# EAGLE schematic uSlices_v3.2 (EAGLE 8.3.2)

## Sheet 1 of 3
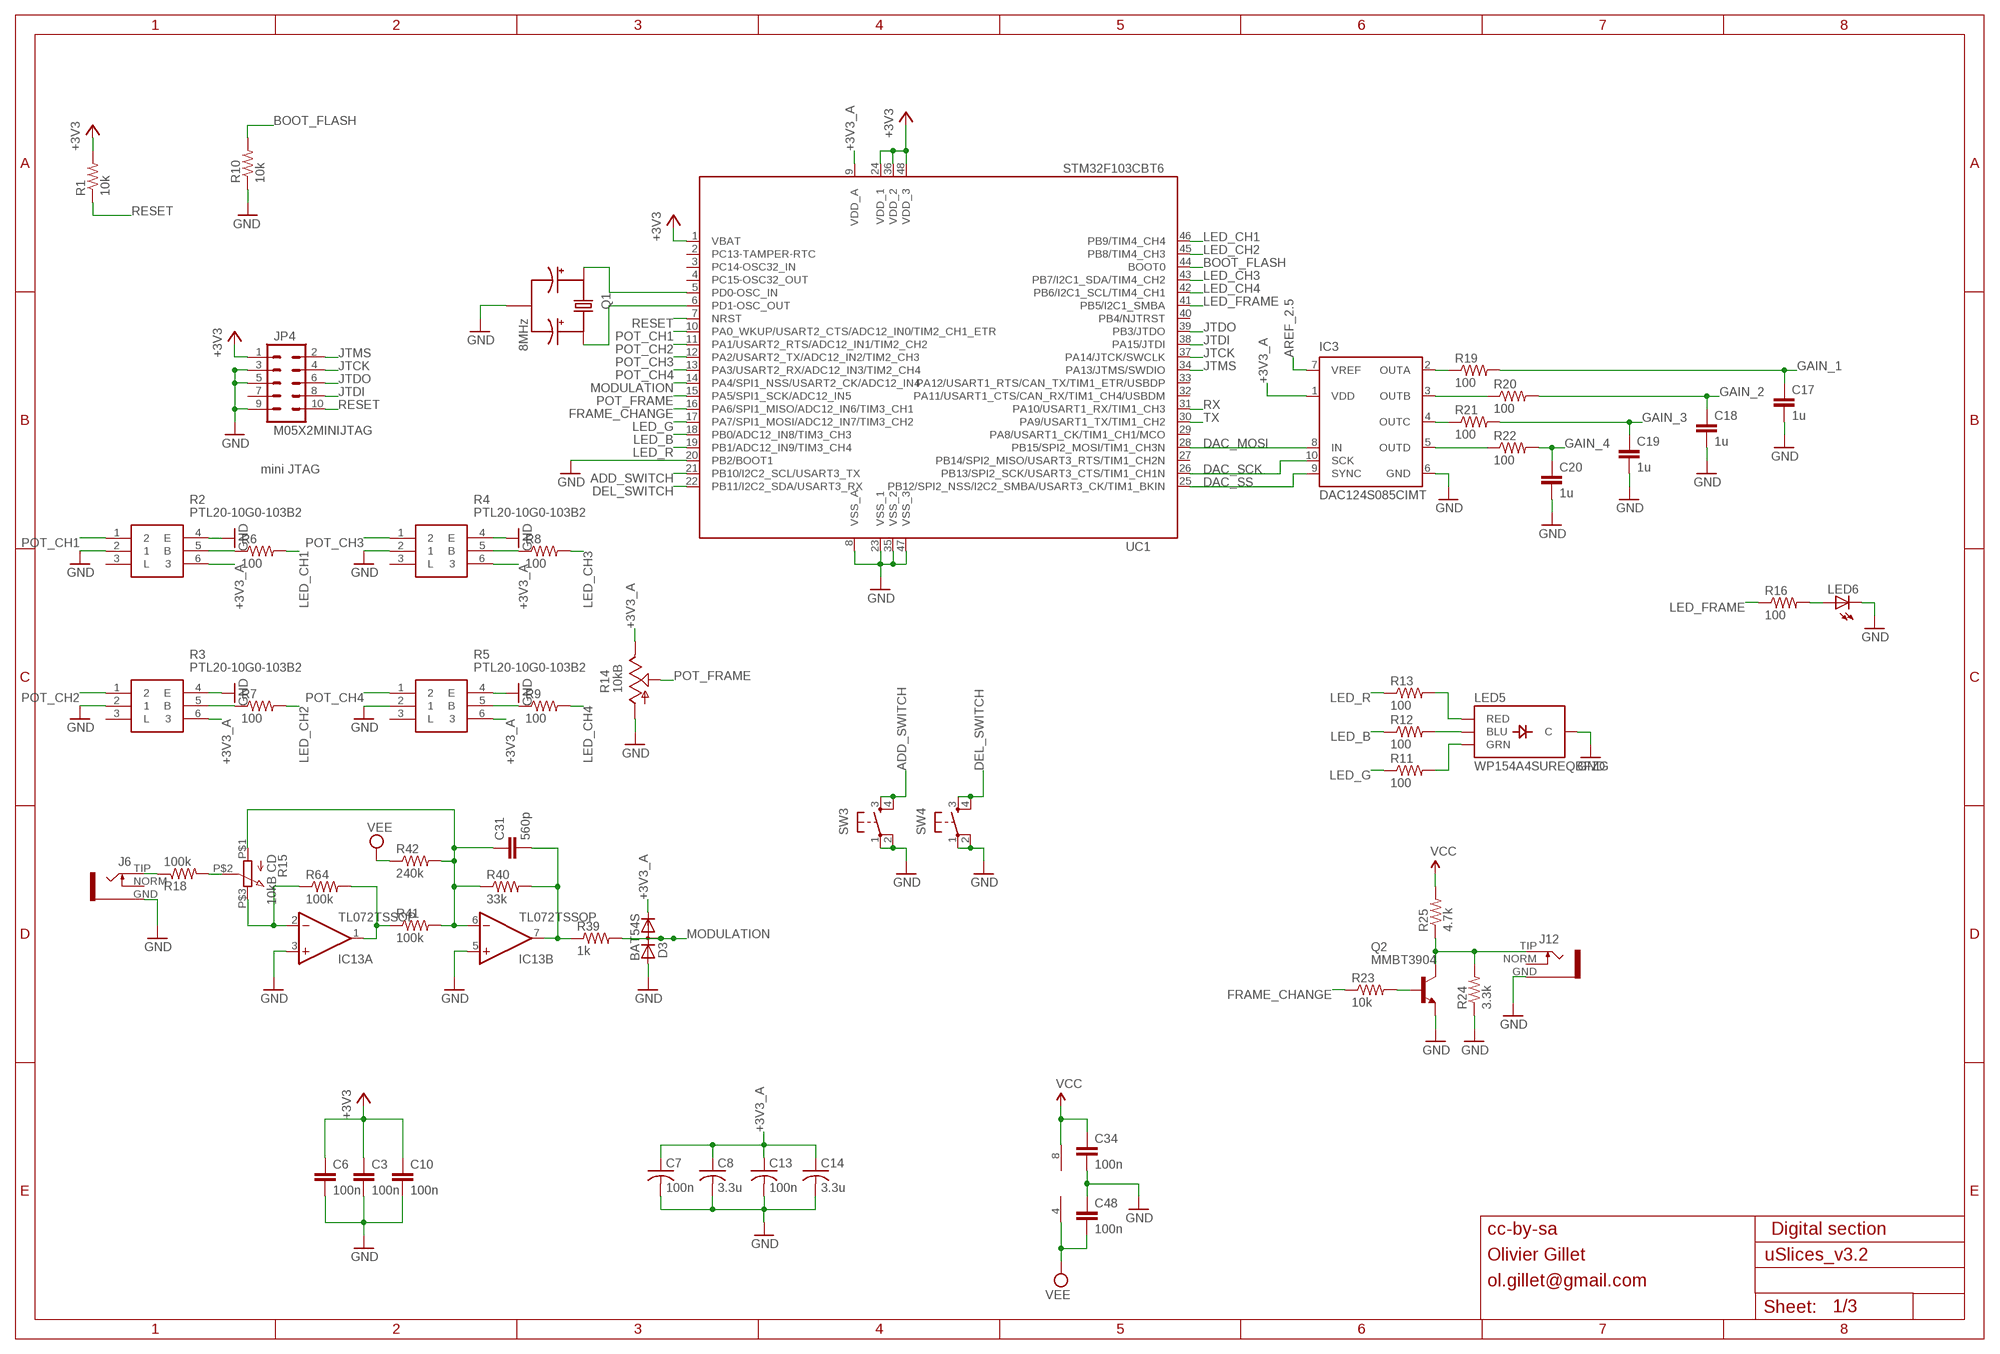
[diagram p0: schematic, sheet 1]

### Parts
C3  100n  PARTS_AMAN_CAPACITOR  [PARTS_AMAN_RESISTOR_0603]
C6  100n  PARTS_AMAN_CAPACITOR  [PARTS_AMAN_RESISTOR_0603]
C7  100n  C-USC0603  [C0603]
C8  3.3u  C-USC0603  [C0603]
C10  100n  PARTS_AMAN_CAPACITOR  [PARTS_AMAN_RESISTOR_0603]
C13  100n  C-USC0603  [C0603]
C14  3.3u  C-USC0603  [C0603]
C17  1u  PARTS_AMAN_CAPACITOR  [PARTS_AMAN_RESISTOR_0603]
C18  1u  PARTS_AMAN_CAPACITOR  [PARTS_AMAN_RESISTOR_0603]
C19  1u  PARTS_AMAN_CAPACITOR  [PARTS_AMAN_RESISTOR_0603]
C20  1u  PARTS_AMAN_CAPACITOR  [PARTS_AMAN_RESISTOR_0603]
C31  560p  PARTS_AMAN_CAPACITOR  [PARTS_AMAN_RESISTOR_0603]
C34  100n  PARTS_AMAN_CAPACITOR  [PARTS_AMAN_RESISTOR_0603]
C48  100n  PARTS_AMAN_CAPACITOR  [PARTS_AMAN_RESISTOR_0603]
D3  BAT54S  DIODE_2CACA-SOT23  [SOT23]
IC3  DAC124S085CIMT  [MSOP10]
IC13  TL072TSSOP  [TSSOP-8]
J6  INSTRUO_S_JACK_S2_INV  [INSTRUO_S_JACK_S2_INV]
J12  INSTRUO_S_JACK_S2_INV  [INSTRUO_S_JACK_S2_INV]
JP4  M05X2MINIJTAG  [2X5-1.27]
LED5  WP154A4SUREQBFZG  LED-TRICOLOR-THROUGHHOLE  [LED-TRICOLOR-THROUGHHOLE]
LED6  LED3MM  [LED3MM]
Q1  8MHz  INSTRUO_CRYSTAL_SMALLER  [INSTRUO_CRYSTAL_SMALLER]
Q2  MMBT3904  MMBT3904LT1-NPN-SOT23-BEC  [SOT23-BEC]
R1  10k  PARTS_AMAN_RESISTOR  [PARTS_AMAN_RESISTOR_0603]
R2  PTL20-10G0-103B2  [PTL2010G0103B2]
R3  PTL20-10G0-103B2  [PTL2010G0103B2]
R4  PTL20-10G0-103B2  [PTL2010G0103B2]
R5  PTL20-10G0-103B2  [PTL2010G0103B2]
R6  100  PARTS_AMAN_RESISTOR  [PARTS_AMAN_RESISTOR_0603]
R7  100  PARTS_AMAN_RESISTOR  [PARTS_AMAN_RESISTOR_0603]
R8  100  PARTS_AMAN_RESISTOR  [PARTS_AMAN_RESISTOR_0603]
R9  100  PARTS_AMAN_RESISTOR  [PARTS_AMAN_RESISTOR_0603]
R10  10k  PARTS_AMAN_RESISTOR  [PARTS_AMAN_RESISTOR_0603]
R11  100  PARTS_AMAN_RESISTOR  [PARTS_AMAN_RESISTOR_0603]
R12  100  PARTS_AMAN_RESISTOR  [PARTS_AMAN_RESISTOR_0603]
R13  100  PARTS_AMAN_RESISTOR  [PARTS_AMAN_RESISTOR_0603]
R14  10kB  POT_USVERTICAL_PS  [ALPS_POT_VERTICAL_PS]
R15  10kB CD  INSTRUO_Q-POT2  [INSTRUO_Q-POT2]
R16  100  PARTS_AMAN_RESISTOR  [PARTS_AMAN_RESISTOR_0603]
R18  100k  R-US_R0603  [R0603]
R19  100  PARTS_AMAN_RESISTOR  [PARTS_AMAN_RESISTOR_0603]
R20  100  PARTS_AMAN_RESISTOR  [PARTS_AMAN_RESISTOR_0603]
R21  100  PARTS_AMAN_RESISTOR  [PARTS_AMAN_RESISTOR_0603]
R22  100  PARTS_AMAN_RESISTOR  [PARTS_AMAN_RESISTOR_0603]
R23  10k  PARTS_AMAN_RESISTOR  [PARTS_AMAN_RESISTOR_0603]
R24  3.3k  PARTS_AMAN_RESISTOR  [PARTS_AMAN_RESISTOR_0603]
R25  4.7k  PARTS_AMAN_RESISTOR  [PARTS_AMAN_RESISTOR_0603]
R39  1k  PARTS_AMAN_RESISTOR  [PARTS_AMAN_RESISTOR_0603]
R40  33k  PARTS_AMAN_RESISTOR  [PARTS_AMAN_RESISTOR_0603]
R41  100k  PARTS_AMAN_RESISTOR  [PARTS_AMAN_RESISTOR_0603]
R42  240k  PARTS_AMAN_RESISTOR  [PARTS_AMAN_RESISTOR_0603]
R64  100k  PARTS_AMAN_RESISTOR  [PARTS_AMAN_RESISTOR_0603]
SW3  SPARKFUN_TAC_SWITCHPTH  [SPARKFUN_TACTILE-PTH]
SW4  SPARKFUN_TAC_SWITCHPTH  [SPARKFUN_TACTILE-PTH]
UC1  STM32F103CBT6  STM32F103CB  [LQFP48]

### Nets
+3V3: C3.1 C6.1 C10.1 JP4.1 R1.2 UC1.1(VBAT) UC1.24(VDD_1) UC1.36(VDD_2) UC1.48(VDD_3) ; also sheet 3
+3V3_A: C7.1 C8.1 C13.1 C14.1 D3.2(C) IC3.1(VDD) R2.6 R3.6 R4.6 R5.6 R14.P$1(E) UC1.9(VDD_A) ; also sheet 3
ADD_SWITCH: SW3.3 SW3.4 UC1.21(PB10/I2C2_SCL/USART3_TX)
AREF_2.5: IC3.7(VREF) ; also sheet 3
BOOT_FLASH: R10.2 UC1.44(BOOT0)
DAC_MOSI: IC3.8(IN) UC1.28(PB15/SPI2_MOSI/TIM1_CH3N)
DAC_SCK: IC3.10(SCK) UC1.26(PB13/SPI2_SCK/USART3_CTS/TIM1_CH1N)
DAC_SS: IC3.9(SYNC) UC1.25(PB12/SPI2_NSS/I2C2_SMBA/USART3_CK/TIM1_BKIN)
DEL_SWITCH: SW4.3 SW4.4 UC1.22(PB11/I2C2_SDA/USART3_RX)
FRAME_CHANGE: R23.1 UC1.16(PA6/SPI1_MISO/ADC12_IN6/TIM3_CH1)
GAIN_1: C17.1 R19.2 ; also sheet 2
GAIN_2: C18.1 R20.2 ; also sheet 2
GAIN_3: C19.1 R21.2 ; also sheet 2
GAIN_4: C20.1 R22.2 ; also sheet 2
GND: C3.2 C6.2 C7.2 C8.2 C10.2 C13.2 C14.2 C17.2 C18.2 C19.2 C20.2 C34.2 C48.1 D3.1(A) IC3.6(GND) IC13.3(A:+IN) IC13.5(B:+IN) J6.GND J12.GND JP4.3 JP4.5 JP4.9 LED5.GND(C) LED6.K(C) Q1.GND Q2.E R2.2 R2.4(E) R3.2 R3.4(E) R4.2 R4.4(E) R5.2 R5.4(E) R10.1 R14.P$3(A) R24.1 SW3.1 SW3.2 SW4.1 SW4.2 UC1.8(VSS_A) UC1.20(PB2/BOOT1) UC1.23(VSS_1) UC1.35(VSS_2) UC1.47(VSS_3) ; also sheet 2,3
JTCK: JP4.4 UC1.37(PA14/JTCK/SWCLK)
JTDI: JP4.8 UC1.38(PA15/JTDI)
JTDO: JP4.6 UC1.39(PB3/JTDO)
JTMS: JP4.2 UC1.34(PA13/JTMS/SWDIO)
LED_B: R12.1 UC1.18(PB0/ADC12_IN8/TIM3_CH3)
LED_CH1: R6.2 UC1.46(PB9/TIM4_CH4)
LED_CH2: R7.2 UC1.45(PB8/TIM4_CH3)
LED_CH3: R8.2 UC1.43(PB7/I2C1_SDA/TIM4_CH2)
LED_CH4: R9.2 UC1.42(PB6/I2C1_SCL/TIM4_CH1)
LED_FRAME: R16.1 UC1.41(PB5/I2C1_SMBA)
LED_G: R11.1 UC1.17(PA7/SPI1_MOSI/ADC12_IN7/TIM3_CH2)
LED_R: R13.1 UC1.19(PB1/ADC12_IN9/TIM3_CH4)
MODULATION: D3.3(AC) R39.2 UC1.14(PA4/SPI1_NSS/USART2_CK/ADC12_IN4)
N$1: IC13.2(A:-IN) R15.P$3 R64.1
N$5: R15.P$2 R18.2
N$6: R2.5(B) R6.1
N$7: Q1.X1 UC1.5(PD0-OSC_IN)
N$8: Q1.X2 UC1.6(PD1-OSC_OUT)
N$9: IC13.1(A:OUT) R41.1 R64.2
N$11: J6.TIP R18.1
N$13: C31.2 IC13.7(B:OUT) R39.1 R40.2
N$14: C31.1 IC13.6(B:-IN) R15.P$1 R40.1 R41.2 R42.2
N$25: LED6.A R16.2
N$35: LED5.RED R13.2
N$36: LED5.BLU R12.2
N$37: LED5.GRN R11.2
N$38: R3.5(B) R7.1
N$39: IC3.2(OUTA) R19.1
N$41: IC3.3(OUTB) R20.1
N$43: IC3.4(OUTC) R21.1
N$44: J12.TIP Q2.C R24.2 R25.1
N$45: IC3.5(OUTD) R22.1
N$46: R4.5(B) R8.1
N$47: Q2.B R23.2
N$52: R5.5(B) R9.1
POT_CH1: R2.1 UC1.10(PA0_WKUP/USART2_CTS/ADC12_IN0/TIM2_CH1_ETR)
POT_CH2: R3.1 UC1.11(PA1/USART2_RTS/ADC12_IN1/TIM2_CH2)
POT_CH3: R4.1 UC1.12(PA2/USART2_TX/ADC12_IN2/TIM2_CH3)
POT_CH4: R5.1 UC1.13(PA3/USART2_RX/ADC12_IN3/TIM2_CH4)
POT_FRAME: R14.P$2(S) UC1.15(PA5/SPI1_SCK/ADC12_IN5)
RESET: JP4.10 R1.1 UC1.7(NRST)
RX: UC1.31(PA10/USART1_RX/TIM1_CH3)
TX: UC1.30(PA9/USART1_TX/TIM1_CH2)
VCC: C34.1 IC13.8(P:V+) R25.2 ; also sheet 2,3
VEE: C48.2 IC13.4(P:V-) R42.1 ; also sheet 2,3
Unconnected: J6.NORM J12.NORM JP4.7 R2.3(L) R3.3(L) R4.3(L) R5.3(L) UC1.2(PC13-TAMPER-RTC) UC1.3(PC14-OSC32_IN) UC1.4(PC15-OSC32_OUT) UC1.27(PB14/SPI2_MISO/USART3_RTS/TIM1_CH2N) UC1.29(PA8/USART1_CK/TIM1_CH1/MCO) UC1.32(PA11/USART1_CTS/CAN_RX/TIM1_CH4/USBDM) UC1.33(PA12/USART1_RTS/CAN_TX/TIM1_ETR/USBDP) UC1.40(PB4/NJTRST)

### Notes on the sheet
- mini JTAG
- cc-by-sa | Digital section
- Olivier Gillet
- ol.gillet@gmail.com

## Sheet 2 of 3
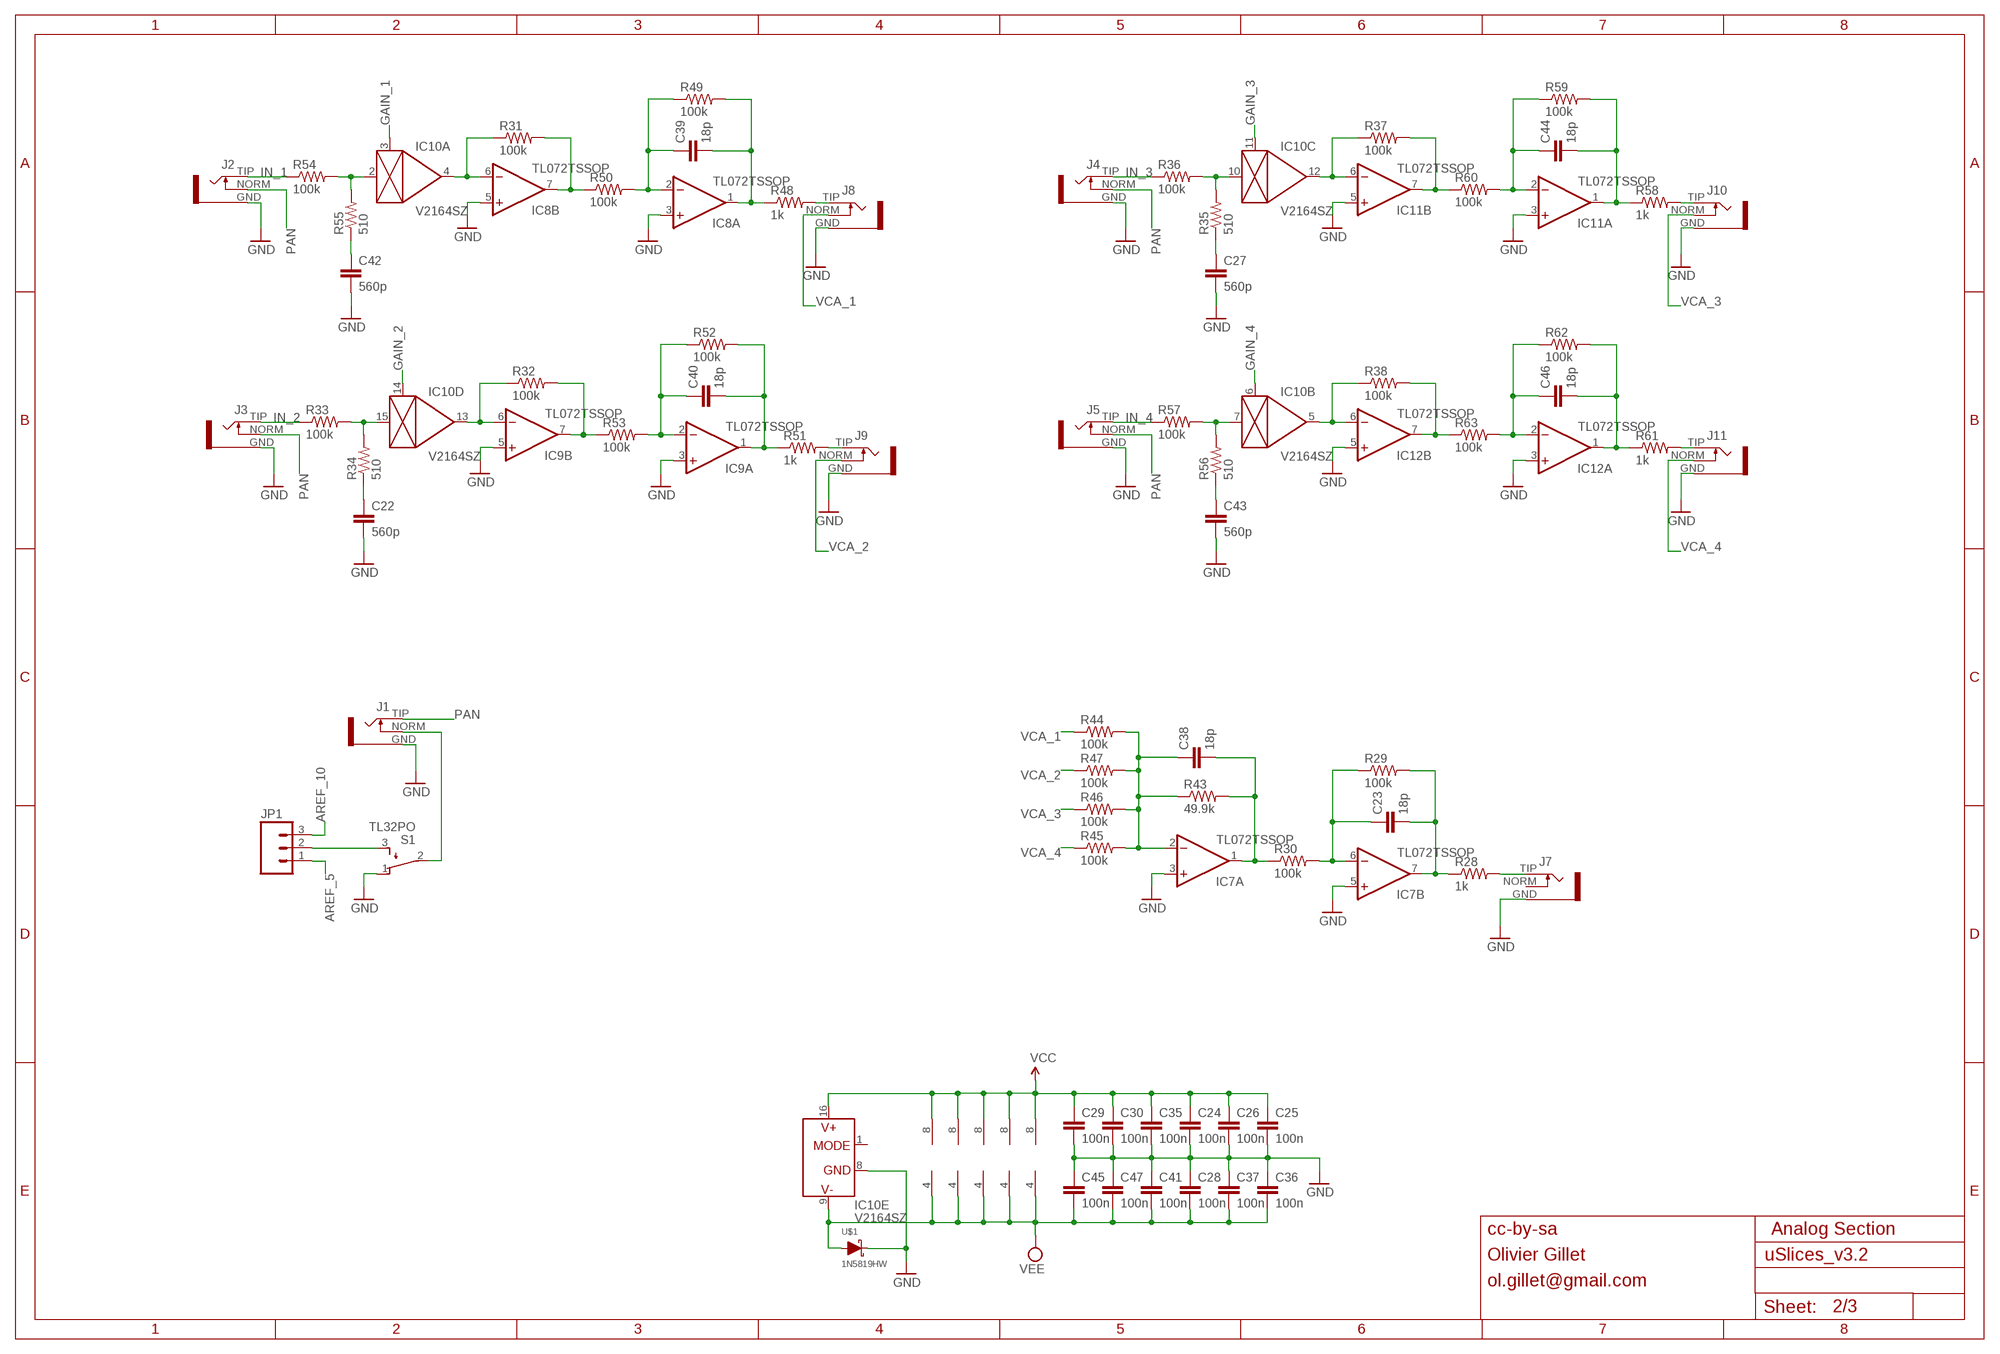
[diagram p1: schematic, sheet 2]

### Parts
C22  560p  PARTS_AMAN_CAPACITOR  [PARTS_AMAN_RESISTOR_0603]
C23  18p  PARTS_AMAN_CAPACITOR  [PARTS_AMAN_RESISTOR_0603]
C24  100n  PARTS_AMAN_CAPACITOR  [PARTS_AMAN_RESISTOR_0603]
C25  100n  PARTS_AMAN_CAPACITOR  [PARTS_AMAN_RESISTOR_0603]
C26  100n  PARTS_AMAN_CAPACITOR  [PARTS_AMAN_RESISTOR_0603]
C27  560p  PARTS_AMAN_CAPACITOR  [PARTS_AMAN_RESISTOR_0603]
C28  100n  PARTS_AMAN_CAPACITOR  [PARTS_AMAN_RESISTOR_0603]
C29  100n  PARTS_AMAN_CAPACITOR  [PARTS_AMAN_RESISTOR_0603]
C30  100n  PARTS_AMAN_CAPACITOR  [PARTS_AMAN_RESISTOR_0603]
C35  100n  PARTS_AMAN_CAPACITOR  [PARTS_AMAN_RESISTOR_0603]
C36  100n  PARTS_AMAN_CAPACITOR  [PARTS_AMAN_RESISTOR_0603]
C37  100n  PARTS_AMAN_CAPACITOR  [PARTS_AMAN_RESISTOR_0603]
C38  18p  PARTS_AMAN_CAPACITOR  [PARTS_AMAN_RESISTOR_0603]
C39  18p  PARTS_AMAN_CAPACITOR  [PARTS_AMAN_RESISTOR_0603]
C40  18p  PARTS_AMAN_CAPACITOR  [PARTS_AMAN_RESISTOR_0603]
C41  100n  PARTS_AMAN_CAPACITOR  [PARTS_AMAN_RESISTOR_0603]
C42  560p  PARTS_AMAN_CAPACITOR  [PARTS_AMAN_RESISTOR_0603]
C43  560p  PARTS_AMAN_CAPACITOR  [PARTS_AMAN_RESISTOR_0603]
C44  18p  PARTS_AMAN_CAPACITOR  [PARTS_AMAN_RESISTOR_0603]
C45  100n  PARTS_AMAN_CAPACITOR  [PARTS_AMAN_RESISTOR_0603]
C46  18p  PARTS_AMAN_CAPACITOR  [PARTS_AMAN_RESISTOR_0603]
C47  100n  PARTS_AMAN_CAPACITOR  [PARTS_AMAN_RESISTOR_0603]
IC7  TL072TSSOP  [TSSOP-8]
IC8  TL072TSSOP  [TSSOP-8]
IC9  TL072TSSOP  [TSSOP-8]
IC10  V2164SZ  SSM2164S  [SOIC16N]
IC11  TL072TSSOP  [TSSOP-8]
IC12  TL072TSSOP  [TSSOP-8]
J1  INSTRUO_S_JACK_S2_INV  [INSTRUO_S_JACK_S2_INV]
J2  INSTRUO_S_JACK_S2_INV  [INSTRUO_S_JACK_S2_INV]
J3  INSTRUO_S_JACK_S2_INV  [INSTRUO_S_JACK_S2_INV]
J4  INSTRUO_S_JACK_S2_INV  [INSTRUO_S_JACK_S2_INV]
J5  INSTRUO_S_JACK_S2_INV  [INSTRUO_S_JACK_S2_INV]
J7  INSTRUO_S_JACK_S2_INV  [INSTRUO_S_JACK_S2_INV]
J8  INSTRUO_S_JACK_S2_INV  [INSTRUO_S_JACK_S2_INV]
J9  INSTRUO_S_JACK_S2_INV  [INSTRUO_S_JACK_S2_INV]
J10  INSTRUO_S_JACK_S2_INV  [INSTRUO_S_JACK_S2_INV]
J11  INSTRUO_S_JACK_S2_INV  [INSTRUO_S_JACK_S2_INV]
JP1  M03PTH  [1X03]
R28  1k  PARTS_AMAN_RESISTOR  [PARTS_AMAN_RESISTOR_0603]
R29  100k  PARTS_AMAN_RESISTOR  [PARTS_AMAN_RESISTOR_0603]
R30  100k  PARTS_AMAN_RESISTOR  [PARTS_AMAN_RESISTOR_0603]
R31  100k  PARTS_AMAN_RESISTOR  [PARTS_AMAN_RESISTOR_0603]
R32  100k  PARTS_AMAN_RESISTOR  [PARTS_AMAN_RESISTOR_0603]
R33  100k  PARTS_AMAN_RESISTOR  [PARTS_AMAN_RESISTOR_0603]
R34  510  PARTS_AMAN_RESISTOR  [PARTS_AMAN_RESISTOR_0603]
R35  510  PARTS_AMAN_RESISTOR  [PARTS_AMAN_RESISTOR_0603]
R36  100k  PARTS_AMAN_RESISTOR  [PARTS_AMAN_RESISTOR_0603]
R37  100k  PARTS_AMAN_RESISTOR  [PARTS_AMAN_RESISTOR_0603]
R38  100k  PARTS_AMAN_RESISTOR  [PARTS_AMAN_RESISTOR_0603]
R43  49.9k  PARTS_AMAN_RESISTOR  [PARTS_AMAN_RESISTOR_0603]
R44  100k  PARTS_AMAN_RESISTOR  [PARTS_AMAN_RESISTOR_0603]
R45  100k  PARTS_AMAN_RESISTOR  [PARTS_AMAN_RESISTOR_0603]
R46  100k  PARTS_AMAN_RESISTOR  [PARTS_AMAN_RESISTOR_0603]
R47  100k  PARTS_AMAN_RESISTOR  [PARTS_AMAN_RESISTOR_0603]
R48  1k  PARTS_AMAN_RESISTOR  [PARTS_AMAN_RESISTOR_0603]
R49  100k  PARTS_AMAN_RESISTOR  [PARTS_AMAN_RESISTOR_0603]
R50  100k  PARTS_AMAN_RESISTOR  [PARTS_AMAN_RESISTOR_0603]
R51  1k  PARTS_AMAN_RESISTOR  [PARTS_AMAN_RESISTOR_0603]
R52  100k  PARTS_AMAN_RESISTOR  [PARTS_AMAN_RESISTOR_0603]
R53  100k  PARTS_AMAN_RESISTOR  [PARTS_AMAN_RESISTOR_0603]
R54  100k  PARTS_AMAN_RESISTOR  [PARTS_AMAN_RESISTOR_0603]
R55  510  PARTS_AMAN_RESISTOR  [PARTS_AMAN_RESISTOR_0603]
R56  510  PARTS_AMAN_RESISTOR  [PARTS_AMAN_RESISTOR_0603]
R57  100k  PARTS_AMAN_RESISTOR  [PARTS_AMAN_RESISTOR_0603]
R58  1k  PARTS_AMAN_RESISTOR  [PARTS_AMAN_RESISTOR_0603]
R59  100k  PARTS_AMAN_RESISTOR  [PARTS_AMAN_RESISTOR_0603]
R60  100k  PARTS_AMAN_RESISTOR  [PARTS_AMAN_RESISTOR_0603]
R61  1k  PARTS_AMAN_RESISTOR  [PARTS_AMAN_RESISTOR_0603]
R62  100k  PARTS_AMAN_RESISTOR  [PARTS_AMAN_RESISTOR_0603]
R63  100k  PARTS_AMAN_RESISTOR  [PARTS_AMAN_RESISTOR_0603]
S1  TL32PO  [TL3XPO]
U$1  1N5819HW  [SOD123]

### Nets
AREF_5: JP1.1 ; also sheet 3
AREF_10: JP1.3 ; also sheet 3
FB_CURRENT: IC10.2(A:IN) R54.2 R55.2
FB_CURRENT1: IC10.15(D:IN) R33.2 R34.2
FB_CURRENT2: IC10.10(C:IN) R35.2 R36.2
FB_CURRENT3: IC10.7(B:IN) R56.2 R57.2
GAIN_1: IC10.3(A:CTRL) ; also sheet 1
GAIN_2: IC10.14(D:CTRL) ; also sheet 1
GAIN_3: IC10.11(C:CTRL) ; also sheet 1
GAIN_4: IC10.6(B:CTRL) ; also sheet 1
GND: C22.2 C24.2 C25.2 C26.2 C27.2 C28.1 C29.2 C30.2 C35.2 C36.1 C37.1 C41.1 C42.2 C43.2 C45.1 C47.1 IC7.3(A:+IN) IC7.5(B:+IN) IC8.3(A:+IN) IC8.5(B:+IN) IC9.3(A:+IN) IC9.5(B:+IN) IC10.8(E:GND) IC11.3(A:+IN) IC11.5(B:+IN) IC12.3(A:+IN) IC12.5(B:+IN) J1.GND J2.GND J3.GND J4.GND J5.GND J7.GND J8.GND J9.GND J10.GND J11.GND S1.1(O) U$1.C(K) ; also sheet 1,3
IN_1: J2.TIP R54.1
IN_2: J3.TIP R33.1
IN_3: J4.TIP R36.1
IN_4: J5.TIP R57.1
N$2: C42.1 R55.1
N$3: J7.TIP R28.2
N$4: IC9.7(B:OUT) R32.2 R53.1
N$10: C27.1 R35.1
N$12: IC8.6(B:-IN) IC10.4(A:OUT) R31.1
N$15: C39.1 IC8.2(A:-IN) R49.1 R50.2
N$16: C39.2 IC8.1(A:OUT) R48.1 R49.2
N$17: C23.2 IC7.7(B:OUT) R28.1 R29.2
N$18: C22.1 R34.1
N$19: C38.1 IC7.2(A:-IN) R43.1 R44.2 R45.2 R46.2 R47.2
N$20: IC9.6(B:-IN) IC10.13(D:OUT) R32.1
N$21: C23.1 IC7.6(B:-IN) R29.1 R30.2
N$22: C40.1 IC9.2(A:-IN) R52.1 R53.2
N$23: C40.2 IC9.1(A:OUT) R51.1 R52.2
N$24: IC10.12(C:OUT) IC11.6(B:-IN) R37.1
N$26: C44.1 IC11.2(A:-IN) R59.1 R60.2
N$27: C44.2 IC11.1(A:OUT) R58.1 R59.2
N$28: C43.1 R56.1
N$29: C38.2 IC7.1(A:OUT) R30.1 R43.2
N$30: IC10.5(B:OUT) IC12.6(B:-IN) R38.1
N$32: C46.1 IC12.2(A:-IN) R62.1 R63.2
N$33: C46.2 IC12.1(A:OUT) R61.1 R62.2
N$34: J1.NORM S1.2(P)
N$40: J8.TIP R48.2
N$42: JP1.2 S1.3(S)
N$48: IC12.7(B:OUT) R38.2 R63.1
N$49: J9.TIP R51.2
N$50: J11.TIP R61.2
N$51: J10.TIP R58.2
PAN: J1.TIP J2.NORM J3.NORM J4.NORM J5.NORM
VCA0_1: IC8.7(B:OUT) R31.2 R50.1
VCA0_3: IC11.7(B:OUT) R37.2 R60.1
VCA_1: J8.NORM R44.1
VCA_2: J9.NORM R47.1
VCA_3: J10.NORM R46.1
VCA_4: J11.NORM R45.1
VCC: C24.1 C25.1 C26.1 C29.1 C30.1 C35.1 IC7.8(P:V+) IC8.8(P:V+) IC9.8(P:V+) IC10.16(E:V+) IC11.8(P:V+) IC12.8(P:V+) ; also sheet 1,3
VEE: C28.2 C36.2 C37.2 C41.2 C45.2 C47.2 IC7.4(P:V-) IC8.4(P:V-) IC9.4(P:V-) IC10.9(E:V-) IC11.4(P:V-) IC12.4(P:V-) U$1.A ; also sheet 1,3
Unconnected: IC10.1(E:MODE) J7.NORM

### Notes on the sheet
- cc-by-sa | Analog Section
- Olivier Gillet
- ol.gillet@gmail.com

## Sheet 3 of 3
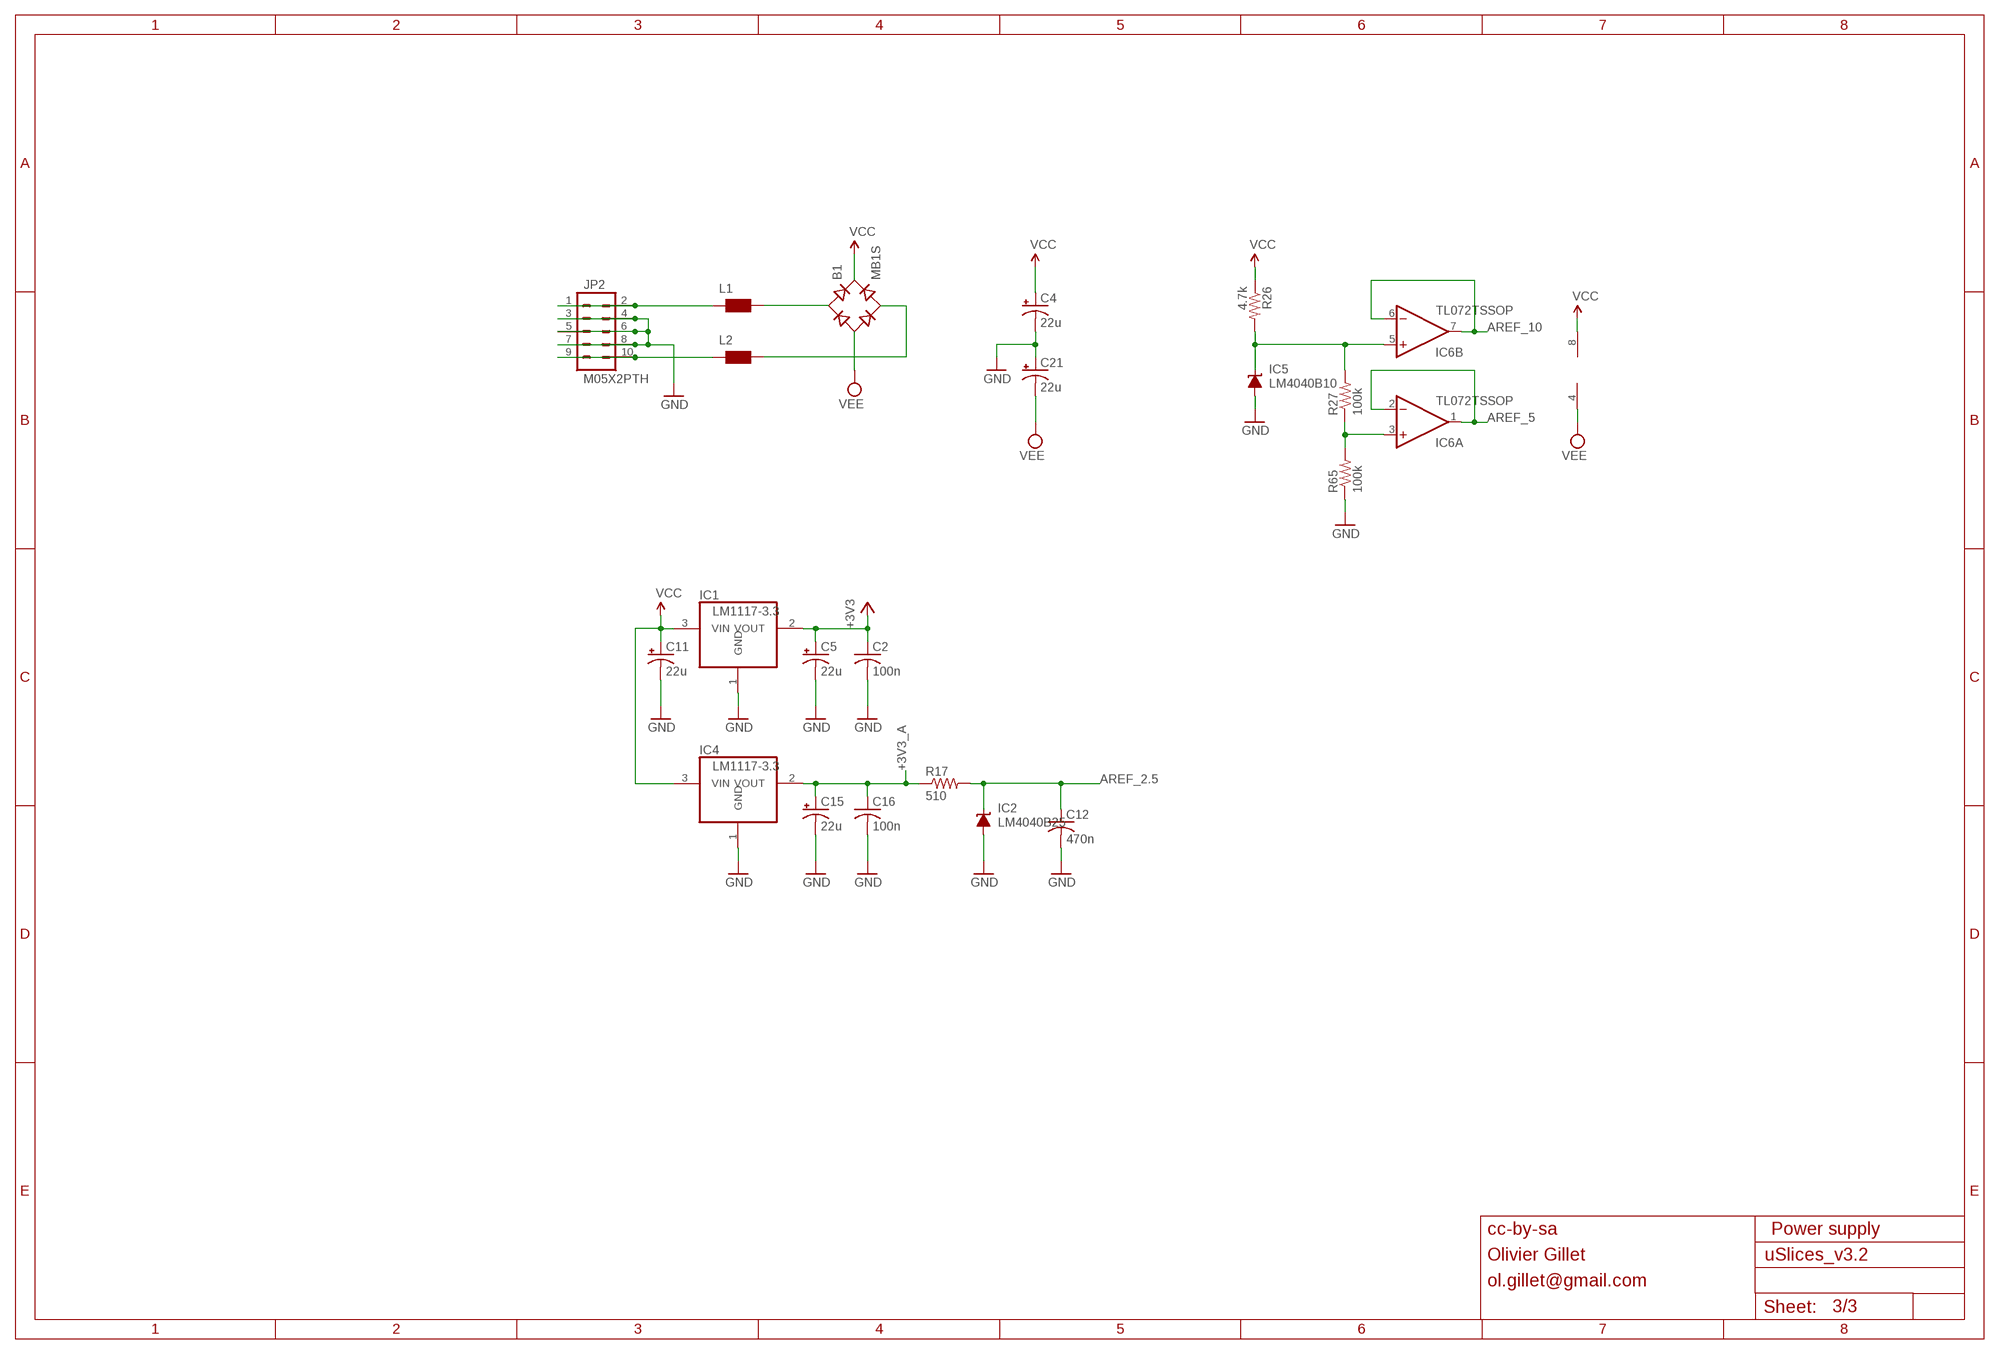
[diagram p2: schematic, sheet 3]

### Parts
B1  MB1S  [SOIC-4]
C2  100n  C-USC0603  [C0603]
C4  22u  CPOL-USC  [PANASONIC_C]
C5  22u  CPOL-USC  [PANASONIC_C]
C11  22u  CPOL-USC  [PANASONIC_C]
C12  470n  C-USC0603  [C0603]
C15  22u  CPOL-USC  [PANASONIC_C]
C16  100n  C-USC0603  [C0603]
C21  22u  CPOL-USC  [PANASONIC_C]
IC1  LM1117-3.3  REG1117  [SOT223]
IC2  LM4040B25  LM4041B12DBZ  [DBZ_R-PDSO-G3]
IC4  LM1117-3.3  REG1117  [SOT223]
IC5  LM4040B10  LM4041B12DBZ  [DBZ_R-PDSO-G3]
IC6  TL072TSSOP  [TSSOP-8]
JP2  M05X2PTH  [AVR_ICSP]
L1  WUERTH-ELEKTRONIK_WE-CBF_0603  [WUERTH-ELEKTRONIK_0603]
L2  WUERTH-ELEKTRONIK_WE-CBF_0603  [WUERTH-ELEKTRONIK_0603]
R17  510  R-US_R0603  [R0603]
R26  4.7k  R-US_R0603  [R0603]
R27  100k  R-US_R0603  [R0603]
R65  100k  R-US_R0603  [R0603]

### Nets
+3V3: C2.1 C5.+ IC1.2(VOUT) ; also sheet 1
+3V3_A: C15.+ C16.1 IC4.2(VOUT) R17.1 ; also sheet 1
AREF_2.5: C12.1 IC2.1(C) R17.2 ; also sheet 1
AREF_5: IC6.1(A:OUT) IC6.2(A:-IN) ; also sheet 2
AREF_10: IC6.6(B:-IN) IC6.7(B:OUT) ; also sheet 2
AREF_10_0: IC5.1(C) IC6.5(B:+IN) R26.2 R27.2
GND: C2.2 C4.- C5.- C11.- C12.2 C15.- C16.2 C21.+ IC1.1(GND) IC2.2(A) IC4.1(GND) IC5.2(A) JP2.3 JP2.4 JP2.5 JP2.6 JP2.7 JP2.8 R65.1 ; also sheet 1,2
N$31: IC6.3(A:+IN) R27.1 R65.2
N$53: B1.~1(AC1) L1.2
N$54: B1.~2(AC2) L2.2
N$56: JP2.1 JP2.2 L1.1
N$64: JP2.9 JP2.10 L2.1
VCC: B1.+ C4.+ C11.+ IC1.3(VIN) IC4.3(VIN) IC6.8(P:V+) R26.1 ; also sheet 1,2
VEE: B1.- C21.- IC6.4(P:V-) ; also sheet 1,2

### Notes on the sheet
- cc-by-sa | Power supply
- Olivier Gillet
- ol.gillet@gmail.com

## Library data of the parts
B1 = rectifier:MB*S: Bridge Rectifier Source: http://www.fairchildsemi.com/ds/MB/MB6S.pdf
C2 C7 C8 C12-C14 C16 = rcl:C-US: CAPACITOR, American symbol
C3 C6 C10 C17-C20 C22-C31 C34-C48 = atom_v1_1_board_2:PARTS_AMAN_CAPACITOR
C4 C5 C11 C15 C21 = rcl:CPOL-US: POLARIZED CAPACITOR, American symbol
D3 = diode:DIODE_2CACA-: 2 Diodes - Cathode-Anode|Cathode-Anode
IC1 IC4 = og-vreg:REG1117: 800mA and 1A Low Dropout (LDO) Positive Regulator 1.8V, 2.5V, 2.85V, 3.3V, 5V, and Adj
IC2 IC5 = texas:LM4041: PRECISION MICROPOWER SHUNT VOLTAGE REFERENCE Source: http://focus.ti.com/lit/ds/slcs146e/slcs146e.pdf
IC3 = og-dac:DAC124S085CIMT
IC6-IC9 IC11-IC13 = MusicThingModular:TL072: Generic Dual Op Amp
IC10 = ssm2164:SSM2164
J1-J12 = uClouds_002_:INSTRUO_S_JACK_S2_INV
JP1 = SparkFun:M03: Header 3 Standard 3-pin 0.1" header. Use with straight break away headers (SKU : PRT-00116), right angle break away headers (PRT-00553), swiss pins (PRT-00743), machine pins (PRT-00117), and female headers (PRT-00115). Molex polarized connector foot print use with SKU : PRT-08232 with associated crimp pins and housings.
JP2 JP4 = og-header:M05X2: Header 5x2 Standard 10-pin dual row 0.1" header. Commonly used with AVR-ISP. Use with Spark Fun Electronics SKU: PRT-00778
L1 L2 = osc_2 board_2_v2.0:WUERTH-ELEKTRONIK_WE-CBF: SMD EMI Suppression Ferrite Beads - excellent anti-EMI properties - low DCR - impedances till 3000 ohms - rated current up to 6 A
LED5 = og-leds:LED-TRICOLOR-THROUGHHOLE
LED6 = led:LED: LED OSRAM: - CHIPLED LG R971, LG N971, LY N971, LG Q971, LY Q971, LO R971, LY R971 LH N974, LH R974 LS Q976, LO Q976, LY Q976 LO Q996 - Hyper CHIPLED LW Q18S LB Q993, LB Q99A, LB R99A - SideLED LS A670, LO A670, LY A670, LG A670, LP A670 LB A673, LV A673, LT A673, LW A673 LH A674 LY A675 LS A676, LA A676, LO A676, LY A676, LW A676 LS A679, LY A679, LG A679 - Hyper Micro SIDELED® LS Y876, LA Y876, LO Y876, LY Y876 LT Y87S - SmartLED LW L88C, LW L88S LB L89C, LB L89S, LG L890 LS L89K, LO L89K, LY L89K LS L896, LA L896, LO L896, LY L896 - TOPLED LS T670, LO T670, LY T670, LG T670, LP T670 LSG T670, LSP T670, LSY T670, LOP T670, LYG T670 LG T671, LOG T671, LSG T671 LB T673, LV T673, LT T673, LW T673 LH T674 LS T676, LA T676, LO T676, LY T676, LB T676, LH T676, LSB T676, LW T676 LB T67C, LV T67C, LT T67C, LS T67K, LO T67K, LY T67K, LW E67C LS E67B, LA E67B, LO E67B, LY E67B, LB E67C, LV E67C, LT E67C LW T67C LS T679, LY T679, LG T679 LS T770, LO T770, LY T770, LG T770, LP T770 LB T773, LV T773, LT T773, LW T773 LH T774 LS E675, LA E675, LY E675, LS T675 LS T776, LA T776, LO T776, LY T776, LB T776 LHGB T686 LT T68C, LB T68C - Hyper Mini TOPLED® LB M676 - Mini TOPLED Santana® LG M470 LS M47K, LO M47K, LY M47K Source: http://www.osram.convergy.de LUXEON: - LUMILED® LXK2-PW12-R00, LXK2-PW12-S00, LXK2-PW14-U00, LXK2-PW14-V00 LXK2-PM12-R00, LXK2-PM12-S00, LXK2-PM14-U00 LXK2-PE12-Q00, LXK2-PE12-R00, LXK2-PE12-S00, LXK2-PE14-T00, LXK2-PE14-U00 LXK2-PB12-K00, LXK2-PB12-L00, LXK2-PB12-M00, LXK2-PB14-N00, LXK2-PB14-P00, LXK2-PB14-Q00 LXK2-PR12-L00, LXK2-PR12-M00, LXK2-PR14-Q00, LXK2-PR14-R00 LXK2-PD12-Q00, LXK2-PD12-R00, LXK2-PD12-S00 LXK2-PH12-R00, LXK2-PH12-S00 LXK2-PL12-P00, LXK2-PL12-Q00, LXK2-PL12-R00 Source: www.luxeon.com KINGBRIGHT: KA-3528ASYC Source: www.kingbright.com
Q1 = uClouds_002_:INSTRUO_CRYSTAL_SMALLER: CSTCE16M0V53-R0
Q2 = transistor:*-NPN-: NPN Transistror BF959 corrected 2008.03.06
R1 R6-R13 R16 R19-R25 R28-R64 = atom_v1_1_board_2:PARTS_AMAN_RESISTOR
R2-R5 = PTL20-10G0-103B2:PTL20-10G0-103B2: Slide Potentiometers Source: Datasheet <http://www.bourns.com/docs/Product-Datasheets/PTL.pdf>; ARROW_PART_NUMBER: PTL30-10O1-103B2; DESCRIPTION: Slide Potentiometers; HEIGHT: 18mm; MANUFACTURER_NAME: Bourns; MANUFACTURER_PART_NUMBER: PTL30-10O1-103B2
R14 = pot-alps:POT_US
R15 = uClouds_002_:INSTRUO_Q-POT2
R17 R18 R26 R27 R65 = rcl:R-US_: RESISTOR, American symbol
S1 = switch:TL32PO: TINY SWITCH ON - MOM Source: http://www2.produktinfo.conrad.com/datenblaetter/700000-724999/705152-da-01-de-Subminiaturschalter_TL_36YO.pdf
SW3 SW4 = uClouds_003:SPARKFUN_TAC_SWITCH: Momentary Switch Button commonly used for reset or general input. Spark Fun Electronics SKU : COM-00097
U$1 = schottky_diodes:1N5819HW: 1.0A SURFACE MOUNT SCHOTTKY BARRIER RECTIFIER 1N5819HW Parameters Diode Type: Schottky Diode Configuration: Single Repetitive Reverse Voltage Vrrm Max: 40V Forward Current If(AV): 1A Forward Voltage VF Max: 750mV Forward Surge Current Ifsm Max: 25A Operating Temperature Range: -65°C to +125°C Diode Case Style: SOD-123 No. of Pins: 2 SVHC: No SVHC (18-Jun-2012) Current Ifsm: 25A Junction Temperature Tj Max: 125°C Package / Case: SOD-123 Termination Type: SMD Features • Guard Ring Die Construction for Transient Protection • Low Power Loss, High Efficiency • High Surge Capability • High Current Capability and Low Forward Voltage Drop • For Use in Low Voltage, High Frequency Inverters, Free Wheeling, and Polarity Protection Application • Lead, Halogen and Antimony Free, RoHS Compliant (Note 1) • "Green" Device (Note 4) Mechanical Data • Case: SOD-123 • Plastic Material: Molded Plastic. UL Flammability Classification Rating 94V-0 • Moisture Sensitivity: Level 1 per J-STD-020 • Polarity: Cathode Band • Leads: Matte Tin Finish annealed over Alloy 42 leadframe (Lead Free Plating) Solderable per MIL-STD-202, Method 208 • Marking Information: See Page 3 • Ordering Information: See Page 3 • Weight: 0.01 grams (approximate); MPN: 1N5819HW-7-F; OC_FARNELL: 1773475; PACKAGE: SOD123; SUPPLIER: DIODES INC
UC1 = stm32:STM32F103CB